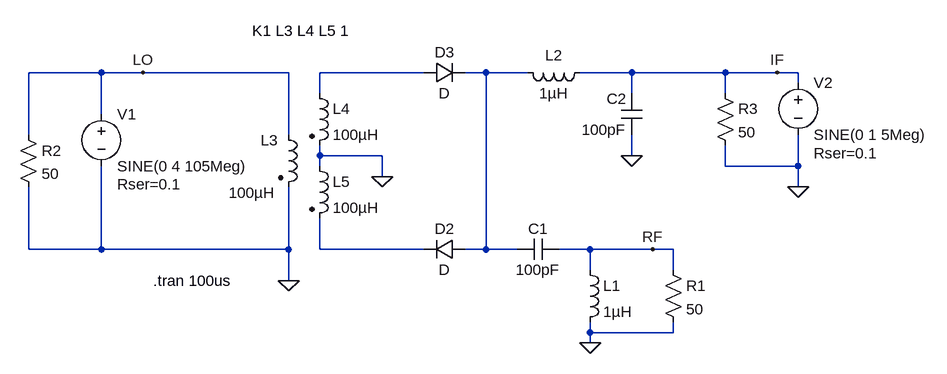
[diagram p0: schematic balanced_diode_mixer.asc]
balanced_diode_mixer.asc, the LTspice schematic file:
Version 4
SHEET 1 1092 680
WIRE -368 160 -480 160
WIRE -304 160 -368 160
WIRE -80 160 -304 160
WIRE 128 160 -32 160
WIRE 224 160 192 160
WIRE 288 160 224 160
WIRE 448 160 368 160
WIRE 592 160 448 160
WIRE 672 160 592 160
WIRE 704 160 672 160
WIRE 704 176 704 160
WIRE -32 192 -32 160
WIRE 448 192 448 160
WIRE 592 192 592 160
WIRE -368 224 -368 160
WIRE -480 256 -480 160
WIRE -80 256 -80 160
WIRE -32 288 -32 272
WIRE 64 288 -32 288
WIRE 448 288 448 256
WIRE -32 304 -32 288
WIRE 592 304 592 272
WIRE 704 304 704 256
WIRE 704 304 592 304
WIRE 64 320 64 288
WIRE 704 336 704 304
WIRE -480 432 -480 336
WIRE -368 432 -368 304
WIRE -368 432 -480 432
WIRE -80 432 -80 336
WIRE -80 432 -368 432
WIRE -32 432 -32 384
WIRE 128 432 -32 432
WIRE 224 432 224 160
WIRE 224 432 192 432
WIRE 272 432 224 432
WIRE 384 432 336 432
WIRE 480 432 384 432
WIRE 512 432 480 432
WIRE 384 464 384 432
WIRE 512 464 512 432
WIRE -80 480 -80 432
WIRE 384 560 384 544
WIRE 512 560 512 544
WIRE 512 560 384 560
WIRE 384 576 384 560
FLAG 384 576 0
FLAG 448 288 0
FLAG 704 336 0
FLAG -304 160 LO
FLAG 672 160 IF
FLAG 480 432 RF
FLAG 64 320 0
FLAG -80 480 0
SYMBOL cap 336 416 R90
WINDOW 0 0 32 VBottom 2
WINDOW 3 32 32 VTop 2
SYMATTR InstName C1
SYMATTR Value 100pF
SYMBOL cap 464 256 R180
WINDOW 0 24 56 Left 2
WINDOW 3 24 8 Left 2
SYMATTR InstName C2
SYMATTR Value 100pF
SYMBOL ind 368 448 R0
SYMATTR InstName L1
SYMATTR Value 1µH
SYMBOL ind 384 144 R90
WINDOW 0 5 56 VBottom 2
WINDOW 3 32 56 VTop 2
SYMATTR InstName L2
SYMATTR Value 1µH
SYMBOL res 496 448 R0
SYMATTR InstName R1
SYMATTR Value 50
SYMBOL voltage -368 208 R0
WINDOW 123 0 0 Left 0
WINDOW 39 24 124 Left 2
SYMATTR InstName V1
SYMATTR Value SINE(0 4 105Meg)
SYMATTR SpiceLine Rser=0.1
SYMBOL voltage 704 160 R0
WINDOW 123 0 0 Left 0
WINDOW 39 24 124 Left 2
SYMATTR InstName V2
SYMATTR Value SINE(0 1 5Meg)
SYMATTR SpiceLine Rser=0.1
SYMBOL res 576 176 R0
SYMATTR InstName R3
SYMATTR Value 50
SYMBOL diode 192 416 R90
WINDOW 0 0 32 VBottom 2
WINDOW 3 32 32 VTop 2
SYMATTR InstName D2
SYMBOL diode 128 176 R270
WINDOW 0 32 32 VTop 2
WINDOW 3 0 32 VBottom 2
SYMATTR InstName D3
SYMBOL ind2 -96 240 R0
WINDOW 0 -27 24 Left 2
WINDOW 3 -76 105 Left 2
SYMATTR InstName L3
SYMATTR Value 100µH
SYMATTR Type ind
SYMBOL ind2 -48 176 R0
SYMATTR InstName L4
SYMATTR Value 100µH
SYMATTR Type ind
SYMBOL ind2 -48 288 R0
SYMATTR InstName L5
SYMATTR Value 100µH
SYMATTR Type ind
SYMBOL res -496 240 R0
SYMATTR InstName R2
SYMATTR Value 50
TEXT -288 480 Left 2 !.tran 100us
TEXT -136 96 Left 2 !K1 L3 L4 L5 1

The netlist it stands for:
* balanced_diode_mixer.asc
C1 RF N002 100pF
C2 0 IF 100pF
L1 RF 0 1µH
L2 IF N002 1µH
R1 RF 0 50
V1 LO 0 SINE(0 4 105Meg) Rser=0.1
V2 IF 0 SINE(0 1 5Meg) Rser=0.1
R3 IF 0 50
D2 N002 N003 D
D3 N001 N002 D
L3 LO 0 100µH
L4 N001 0 100µH
L5 0 N003 100µH
R2 LO 0 50
.model D D
.lib standard.dio
.tran 100us
K1 L3 L4 L5 1
.backanno
.end